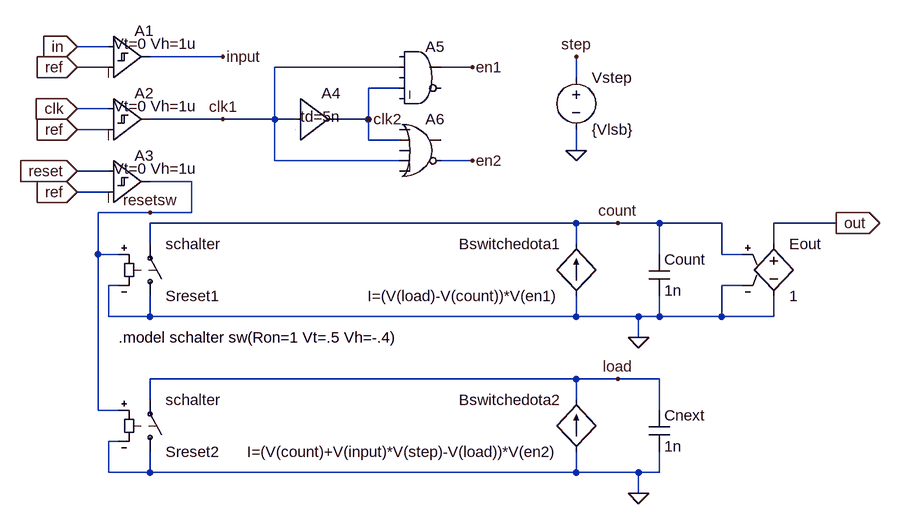
[diagram p0: schematic counter.asc]
counter.asc, the LTspice schematic file:
Version 4
SHEET 1 1108 680
WIRE -272 -208 -320 -208
WIRE -96 -192 -208 -192
WIRE -272 -176 -320 -176
WIRE 176 -176 -16 -176
WIRE 288 -176 240 -176
WIRE 448 -160 448 -192
WIRE 176 -144 128 -144
WIRE -272 -112 -320 -112
WIRE -96 -96 -208 -96
WIRE -16 -96 -16 -176
WIRE -16 -96 -96 -96
WIRE 16 -96 -16 -96
WIRE 128 -96 128 -144
WIRE 128 -96 80 -96
WIRE -272 -80 -320 -80
WIRE 128 -64 128 -96
WIRE 176 -64 128 -64
WIRE 448 -48 448 -80
WIRE -16 -32 -16 -96
WIRE 176 -32 -16 -32
WIRE 288 -32 240 -32
WIRE -272 -16 -320 -16
WIRE -144 0 -208 0
WIRE -272 16 -320 16
WIRE -208 48 -288 48
WIRE -144 48 -144 0
WIRE -144 48 -208 48
WIRE 448 64 -208 64
WIRE 512 64 448 64
WIRE 576 64 512 64
WIRE 672 64 576 64
WIRE 848 64 752 64
WIRE -208 96 -208 64
WIRE 448 96 448 64
WIRE 752 96 752 64
WIRE -288 112 -288 48
WIRE -256 112 -288 112
WIRE 576 112 576 64
WIRE 672 112 672 64
WIRE 704 112 672 112
WIRE -256 160 -272 160
WIRE 704 160 672 160
WIRE -272 208 -272 160
WIRE -208 208 -208 176
WIRE -208 208 -272 208
WIRE 448 208 448 176
WIRE 448 208 -208 208
WIRE 544 208 448 208
WIRE 576 208 576 176
WIRE 576 208 544 208
WIRE 672 208 672 160
WIRE 672 208 576 208
WIRE 752 208 752 176
WIRE 752 208 672 208
WIRE 544 240 544 208
WIRE 448 304 -208 304
WIRE 512 304 448 304
WIRE 576 304 512 304
WIRE -208 336 -208 304
WIRE 448 336 448 304
WIRE -288 352 -288 112
WIRE -256 352 -288 352
WIRE 576 352 576 304
WIRE -256 400 -272 400
WIRE -272 448 -272 400
WIRE -208 448 -208 416
WIRE -208 448 -272 448
WIRE 448 448 448 416
WIRE 448 448 -208 448
WIRE 544 448 448 448
WIRE 576 448 576 416
WIRE 576 448 544 448
WIRE 544 480 544 448
FLAG 544 240 0
FLAG 512 64 count
FLAG 448 -48 0
FLAG 448 -192 step
FLAG -320 -208 in
IOPIN -320 -208 In
FLAG -320 -176 ref
IOPIN -320 -176 In
FLAG -96 -192 input
FLAG -320 -112 clk
IOPIN -320 -112 In
FLAG -320 -80 ref
IOPIN -320 -80 In
FLAG -96 -96 clk1
FLAG -320 -16 reset
IOPIN -320 -16 In
FLAG -320 16 ref
IOPIN -320 16 In
FLAG -208 48 resetsw
FLAG 544 480 0
FLAG 512 304 load
FLAG 128 -96 clk2
FLAG 288 -176 en1
FLAG 288 -32 en2
FLAG 848 64 out
IOPIN 848 64 Out
SYMBOL cap 560 112 R0
SYMATTR InstName Count
SYMATTR Value 1n
SYMBOL bi2 448 96 M0
SYMATTR InstName Bswitchedota1
SYMATTR Value I=(V(load)-V(count))*V(en1)
SYMBOL voltage 448 -176 R0
SYMATTR InstName Vstep
SYMATTR Value {Vlsb}
SYMBOL Digital\\diffschmtbuf -272 -256 R0
WINDOW 3 8 44 Left 0
SYMATTR Value Vt=0 Vh=1u
SYMATTR InstName A1
SYMBOL Digital\\diffschmtbuf -272 -160 R0
WINDOW 3 8 44 Left 0
SYMATTR Value Vt=0 Vh=1u
SYMATTR InstName A2
SYMBOL Digital\\diffschmtbuf -272 -64 R0
WINDOW 3 8 44 Left 0
SYMATTR Value Vt=0 Vh=1u
SYMATTR InstName A3
SYMBOL sw -208 192 M180
SYMATTR InstName Sreset1
SYMATTR Value schalter
SYMBOL cap 560 352 R0
SYMATTR InstName Cnext
SYMATTR Value 1n
SYMBOL bi2 448 336 M0
SYMATTR InstName Bswitchedota2
SYMATTR Value I=(V(count)+V(input)*V(step)-V(load))*V(en2)
SYMBOL sw -208 432 M180
SYMATTR InstName Sreset2
SYMATTR Value schalter
SYMBOL Digital\\buf1 16 -160 R0
WINDOW 3 8 60 Left 0
SYMATTR Value td=5n
SYMATTR InstName A4
SYMBOL Digital\\and 208 -224 R0
SYMATTR InstName A5
SYMBOL Digital\\or 208 -112 R0
SYMATTR InstName A6
SYMBOL e 752 80 R0
SYMATTR InstName Eout
SYMATTR Value 1
TEXT -256 240 Left 0 !.model schalter sw(Ron=1 Vt=.5 Vh=-.4)

The netlist it stands for:
* counter.asc
Count count 0 1n
Bswitchedota1 0 count I=(V(load)-V(count))*V(en1)
Vstep step 0 {Vlsb}
A1 in ref 0 0 0 0 input 0 SCHMITT Vt=0 Vh=1u
A2 clk ref 0 0 0 0 clk1 0 SCHMITT Vt=0 Vh=1u
A3 reset ref 0 0 0 0 resetsw 0 SCHMITT Vt=0 Vh=1u
Sreset1 0 count resetsw 0 schalter
Cnext load 0 1n
Bswitchedota2 0 load I=(V(count)+V(input)*V(step)-V(load))*V(en2)
Sreset2 0 load resetsw 0 schalter
A4 clk1 0 0 0 0 0 clk2 0 BUF td=5n
A5 0 clk1 0 clk2 0 0 en1 0 AND
A6 0 clk2 0 clk1 0 en2 0 0 OR
Eout out 0 count 0 1
.model schalter sw(Ron=1 Vt=.5 Vh=-.4)
.backanno
.end